# EAGLE design Buzzer (EAGLE 7.4.0)
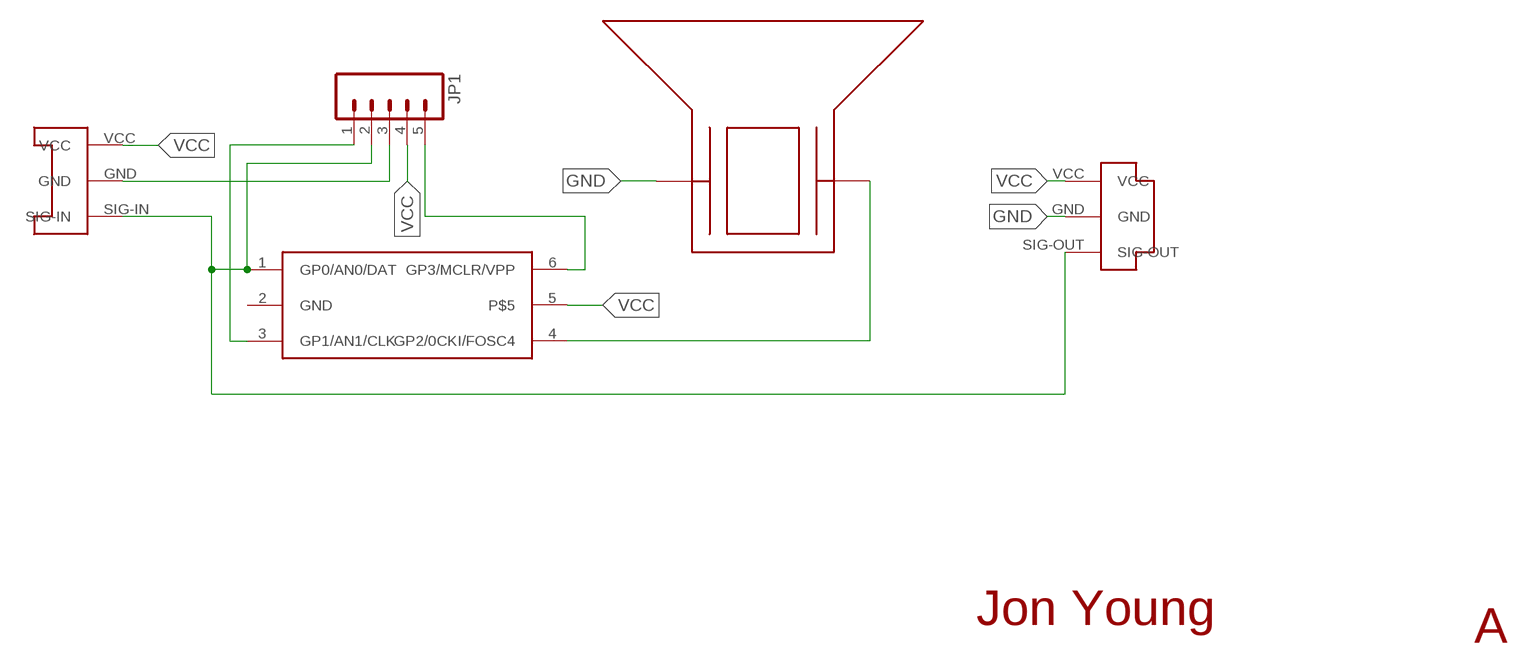
[diagram p0: schematic, sheet 1]

## Parts
JP1  M051.27MM  [1X05-1.27MM]
U$1  CONN-PLUG-3POS-3MM  [PLUG-3POS-3MM-SMD]
U$2  CONN-SOCKET-3POS-3MM  [SOCKET-3POS-3MM-SMD]
U$3  BUZZER  [BUZZER-PKMCS0909E4000-R1]
U$6  PIC10F2XXT-I/OT  [SOT23-6]

## Nets
GND: JP1.3 U$1.GND U$2.GND U$3.P$1
N$5: JP1.1 U$6.3(GP1/AN1/CLK)
N$6: JP1.2 U$1.SIG-OUT U$2.SIG-IN U$6.1(GP0/AN0/DAT)
SIG-IN: U$3.P$2 U$6.4(GP2/0CKI/FOSC4)
VCC: JP1.4 JP1.5 U$1.VCC U$2.VCC U$6.6(GP3/MCLR/VPP)

## Notes on the sheet
- Jon Young
- A

## Power pins joined to a net without a drawn wire
GND: U$6.2(GND)
P$5: U$6.5

## Library data of the parts
JP1 = SparkFun-Connectors:M05: Header 5 Standard 5-pin 0.1" header. Use with straight break away headers (SKU : PRT-00116), right angle break away headers (PRT-00553), swiss pins (PRT-00743), machine pins (PRT-00117), and female headers (PRT-00115). Molex polarized connector foot print use with SKU : PRT-08230 with associated crimp pins and housings.
U$1 = EmbeddedPlayground:CONN-PLUG-3POS-3MM: Surface mount board to board connector. Female socket, 3 position.
U$2 = EmbeddedPlayground:CONN-SOCKET-3POS-3MM: Surface mount board to board connector. Female socket, 3 position.
U$3 = EmbeddedPlayground:BUZZER
U$6 = EmbeddedPlayground:PIC10F2XXT-I/OT

## Board
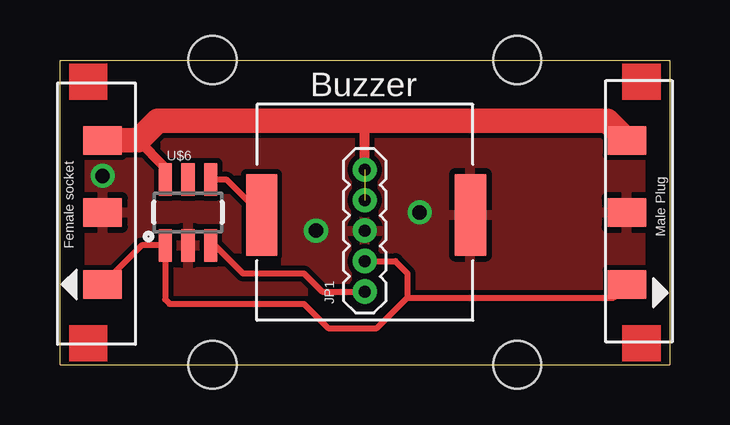
[diagram p1: board, top side]
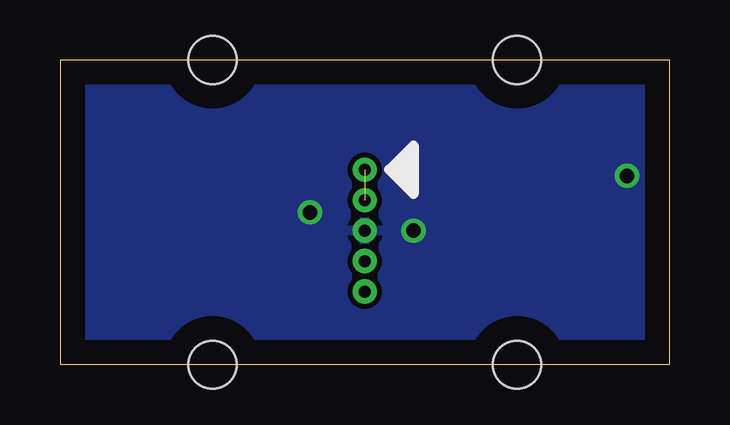
[diagram p2: board, bottom side, seen from below]

Size 25.4 x 12.7 mm. Coordinates in mm from the lower left corner, seen from the top.
Outline: 0,0 25.4,0 25.4,12.7 0,12.7 0,0
Copper layers (1*16): Top 0.035mm / dielectric 1.5mm / Bottom 0.035mm
Design rules "default": minimum track width 10mil, minimum drill 24mil, track to track 8mil, track to pad 8mil, pad to pad 8mil, via to via 8mil, smd to smd 8mil, copper to edge 40mil, drill to drill 8mil, minimum pad ring 10mil, minimum via ring 8mil, stop-mask expansion 4mil, vias tented up to drill 0mil, thermal gap 10mil
Holes 2 mm at 6.35,0 6.35,12.7 19.05,12.7 19.05,0

### Footprints (pad centres in the part's own frame; a part is rotated, then mirrored left to right if it is on the bottom)
1X05-1.27MM = drill 0.508 pad 1: 1 0,0; 2 1.27,0; 3 2.54,0; 4 3.81,0; 5 5.08,0
PLUG-3POS-3MM-SMD = smd 1.2 x 1.6: GND 0,0; SIG-OUT 3,0; VCC -3,0
SOCKET-3POS-3MM-SMD = smd 1.2 x 1.6: GND 0,0; SIG-IN -3,0; VCC 3,0
BUZZER-PKMCS0909E4000-R1 = smd 1.3 x 3.4: P$1 -4.4,0.1; P$2 4.3,0.1
SOT23-6 = smd 0.55 x 1.35: 1 -0.95,-1.375; 2 0,-1.375; 3 0.95,-1.375; 4 0.95,1.375; 5 0,1.375; 6 -0.95,1.375

### Placement (x,y rotation side)
JP1  12.7,3.05 90 top
U$1  23.62,6.35 270 top
U$2  1.78,6.35 90 top
U$3  12.7,6.35 180 top
U$6  5.33,6.35 0 top

### Tracks (layer width: path | path; a pad name or v marks a point on that pad's centre or on a via)
GND  (via drill 0.6)
  other vias: 10.67,5.59 14.99,6.35 1.78,7.87
  pour Top: -1.27,13.91 -1.02,-1.27 29.37,-1.27 29.12,13.91
  pour Bottom: -1.27,13.91 26.58,13.91 26.58,-1.27 -1.27,-1.27
N$5
  Top 0.254: U$6.3 6.46,4.97 7.62,3.81 10.16,3.81 10.92,3.05 JP1.1
N$6
  Top 0.254: U$2.SIG-IN 3.4,4.97 U$6.1 4.38,2.73 4.57,2.54 10.16,2.54 11.18,1.52 13.21,1.52 14.48,2.79 | JP1.2 13.97,4.32 14.48,3.81 14.48,2.79 | 14.48,2.79 23.07,2.79 U$1.SIG-OUT
SIG-IN
  Top 0.254: U$6.4 6.92,7.72 U$3.P$2
VCC  (1 unrouted)
  Top 0.406: JP1.5 12.7,10.16 | U$6.6 4.38,8.22 3.25,9.35
  Top 1.016: U$2.VCC 3.25,9.35 4.06,10.16 12.7,10.16 22.81,10.16 U$1.VCC

### Text on the board
tPlace: Buzzer